# EAGLE schematic CharacterRom (EAGLE 7.3.0)

## Sheet 1 of 2
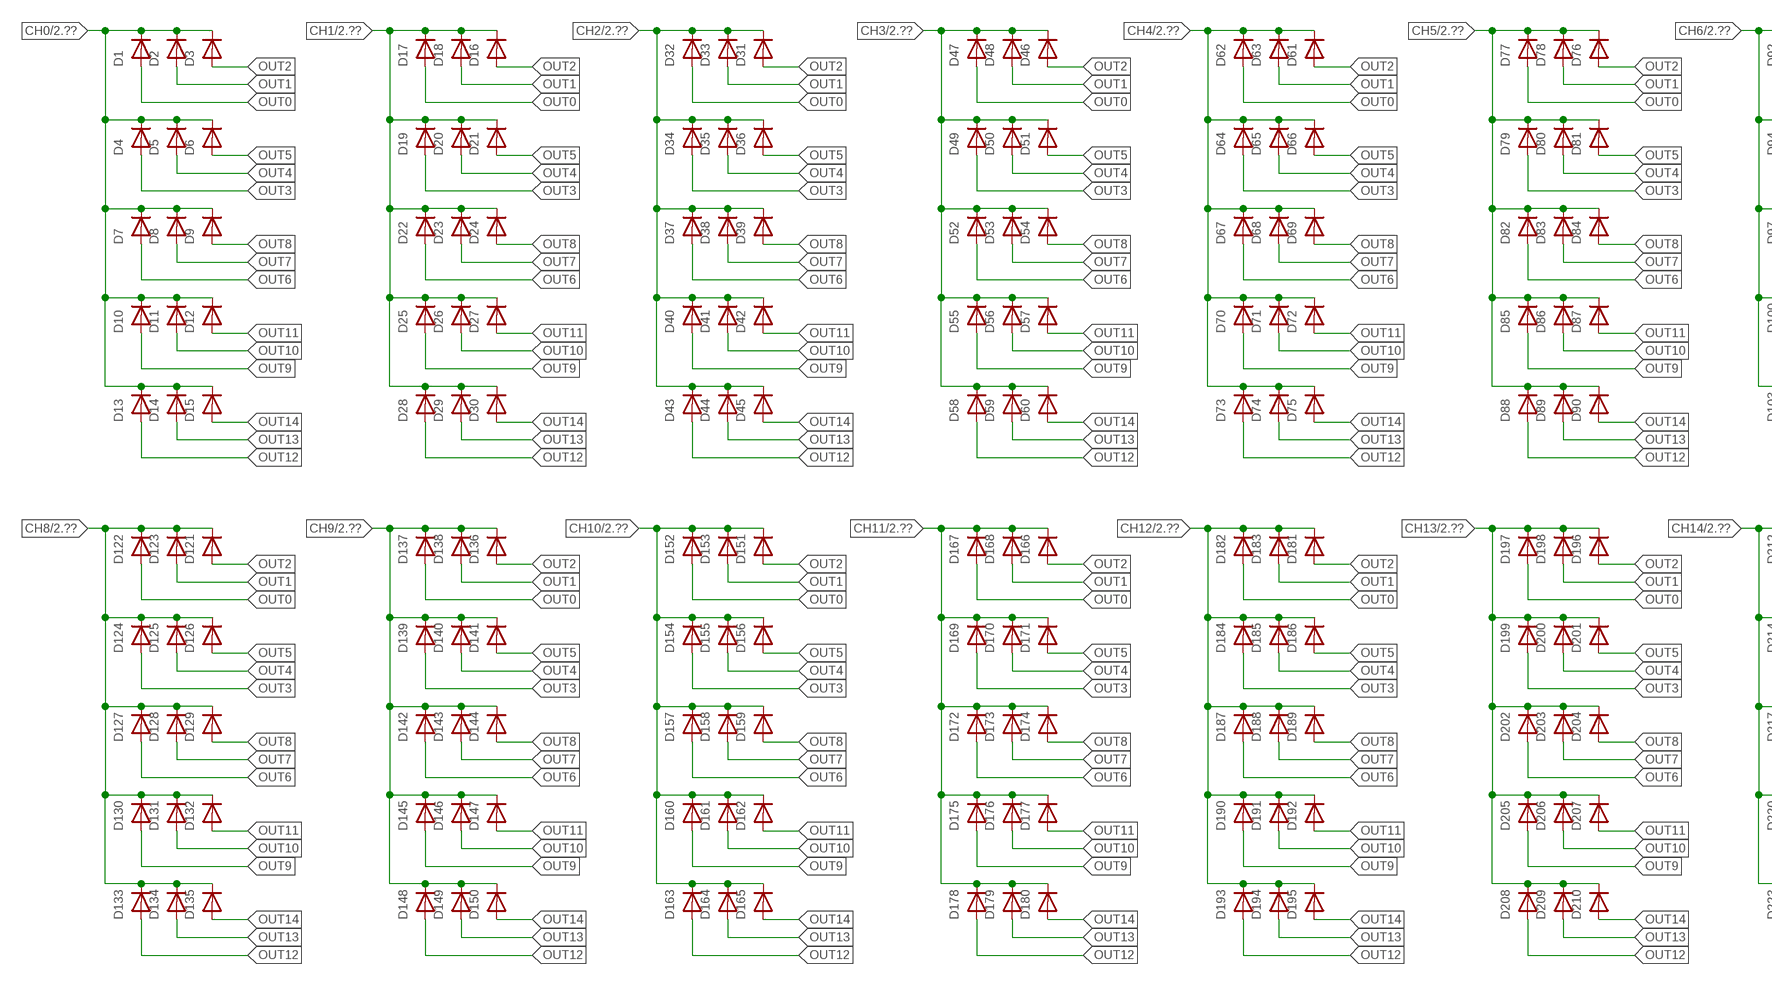
[diagram p0: schematic, sheet 1, part 1 of 2]
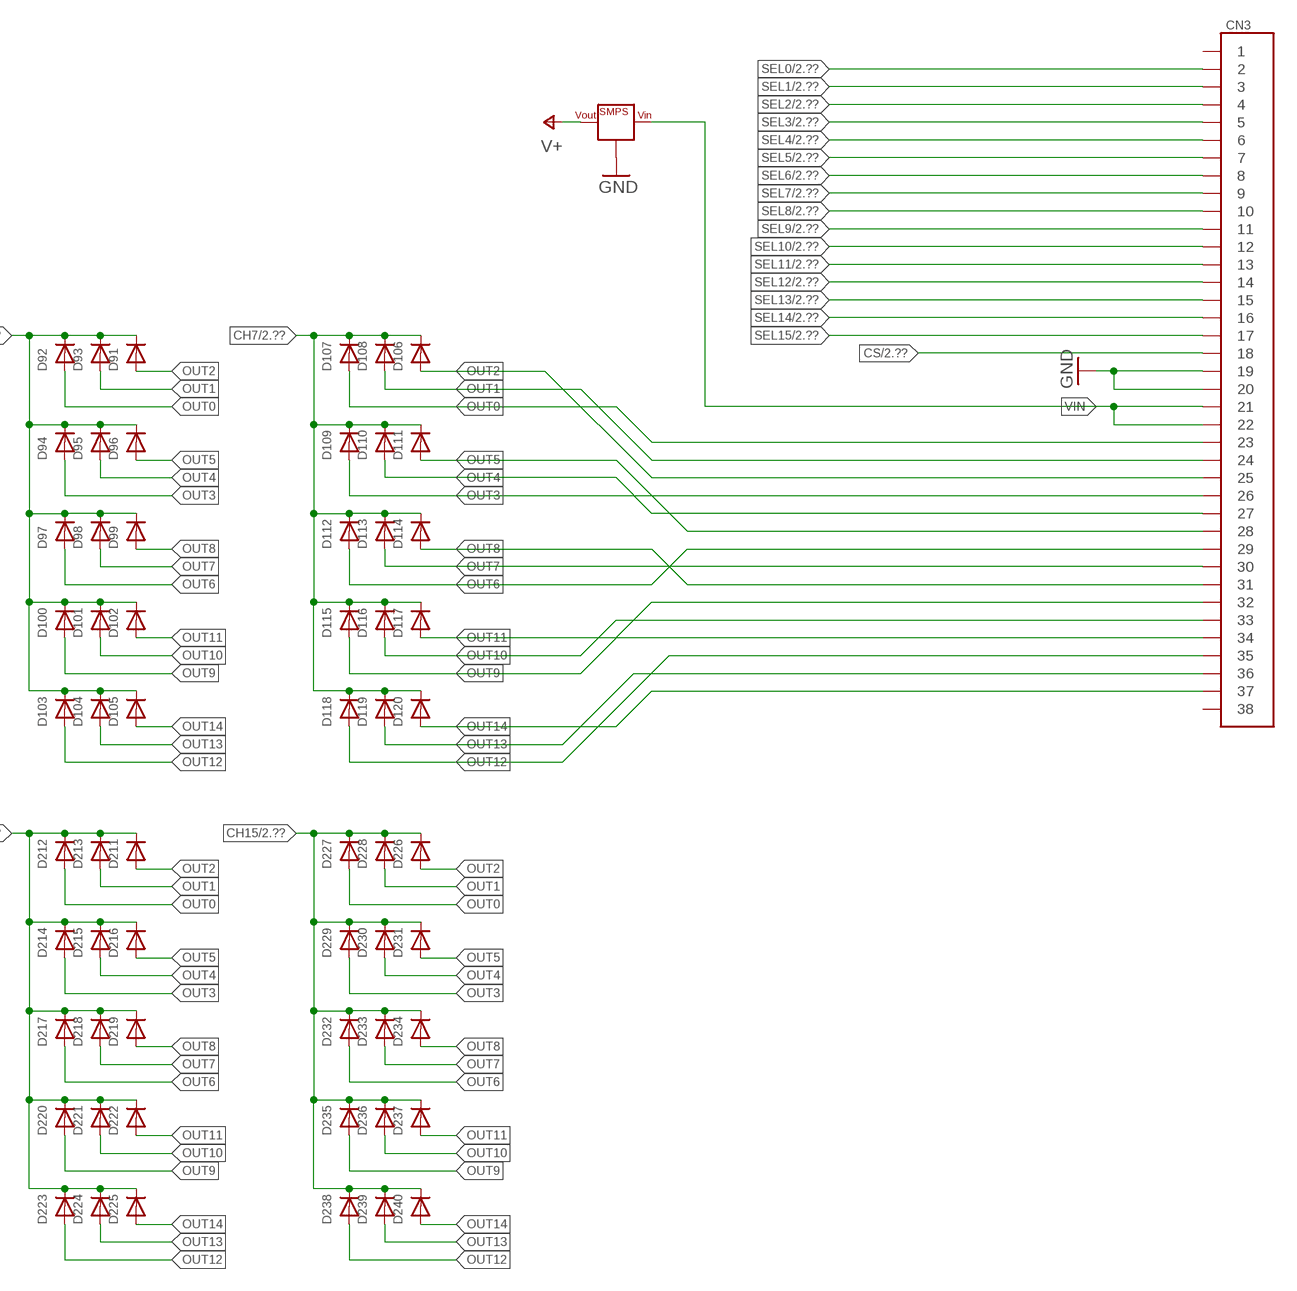
[diagram p1: schematic, sheet 1, part 2 of 2]

### Parts
CN3  HD38-HP  [HD38-HOLEPAD]
D1  DIODESOD-323F  [SOD-323F]
D2  DIODESOD-323F  [SOD-323F]
D3  DIODESOD-323F  [SOD-323F]
D4  DIODESOD-323F  [SOD-323F]
D5  DIODESOD-323F  [SOD-323F]
D6  DIODESOD-323F  [SOD-323F]
D7  DIODESOD-323F  [SOD-323F]
D8  DIODESOD-323F  [SOD-323F]
D9  DIODESOD-323F  [SOD-323F]
D10  DIODESOD-323F  [SOD-323F]
D11  DIODESOD-323F  [SOD-323F]
D12  DIODESOD-323F  [SOD-323F]
D13  DIODESOD-323F  [SOD-323F]
D14  DIODESOD-323F  [SOD-323F]
D15  DIODESOD-323F  [SOD-323F]
D16  DIODESOD-323F  [SOD-323F]
D17  DIODESOD-323F  [SOD-323F]
D18  DIODESOD-323F  [SOD-323F]
D19  DIODESOD-323F  [SOD-323F]
D20  DIODESOD-323F  [SOD-323F]
D21  DIODESOD-323F  [SOD-323F]
D22  DIODESOD-323F  [SOD-323F]
D23  DIODESOD-323F  [SOD-323F]
D24  DIODESOD-323F  [SOD-323F]
D25  DIODESOD-323F  [SOD-323F]
D26  DIODESOD-323F  [SOD-323F]
D27  DIODESOD-323F  [SOD-323F]
D28  DIODESOD-323F  [SOD-323F]
D29  DIODESOD-323F  [SOD-323F]
D30  DIODESOD-323F  [SOD-323F]
D31  DIODESOD-323F  [SOD-323F]
D32  DIODESOD-323F  [SOD-323F]
D33  DIODESOD-323F  [SOD-323F]
D34  DIODESOD-323F  [SOD-323F]
D35  DIODESOD-323F  [SOD-323F]
D36  DIODESOD-323F  [SOD-323F]
D37  DIODESOD-323F  [SOD-323F]
D38  DIODESOD-323F  [SOD-323F]
D39  DIODESOD-323F  [SOD-323F]
D40  DIODESOD-323F  [SOD-323F]
D41  DIODESOD-323F  [SOD-323F]
D42  DIODESOD-323F  [SOD-323F]
D43  DIODESOD-323F  [SOD-323F]
D44  DIODESOD-323F  [SOD-323F]
D45  DIODESOD-323F  [SOD-323F]
D46  DIODESOD-323F  [SOD-323F]
D47  DIODESOD-323F  [SOD-323F]
D48  DIODESOD-323F  [SOD-323F]
D49  DIODESOD-323F  [SOD-323F]
D50  DIODESOD-323F  [SOD-323F]
D51  DIODESOD-323F  [SOD-323F]
D52  DIODESOD-323F  [SOD-323F]
D53  DIODESOD-323F  [SOD-323F]
D54  DIODESOD-323F  [SOD-323F]
D55  DIODESOD-323F  [SOD-323F]
D56  DIODESOD-323F  [SOD-323F]
D57  DIODESOD-323F  [SOD-323F]
D58  DIODESOD-323F  [SOD-323F]
D59  DIODESOD-323F  [SOD-323F]
D60  DIODESOD-323F  [SOD-323F]
D61  DIODESOD-323F  [SOD-323F]
D62  DIODESOD-323F  [SOD-323F]
D63  DIODESOD-323F  [SOD-323F]
D64  DIODESOD-323F  [SOD-323F]
D65  DIODESOD-323F  [SOD-323F]
D66  DIODESOD-323F  [SOD-323F]
D67  DIODESOD-323F  [SOD-323F]
D68  DIODESOD-323F  [SOD-323F]
D69  DIODESOD-323F  [SOD-323F]
D70  DIODESOD-323F  [SOD-323F]
D71  DIODESOD-323F  [SOD-323F]
D72  DIODESOD-323F  [SOD-323F]
D73  DIODESOD-323F  [SOD-323F]
D74  DIODESOD-323F  [SOD-323F]
D75  DIODESOD-323F  [SOD-323F]
D76  DIODESOD-323F  [SOD-323F]
D77  DIODESOD-323F  [SOD-323F]
D78  DIODESOD-323F  [SOD-323F]
D79  DIODESOD-323F  [SOD-323F]
D80  DIODESOD-323F  [SOD-323F]
D81  DIODESOD-323F  [SOD-323F]
D82  DIODESOD-323F  [SOD-323F]
D83  DIODESOD-323F  [SOD-323F]
D84  DIODESOD-323F  [SOD-323F]
D85  DIODESOD-323F  [SOD-323F]
D86  DIODESOD-323F  [SOD-323F]
D87  DIODESOD-323F  [SOD-323F]
D88  DIODESOD-323F  [SOD-323F]
D89  DIODESOD-323F  [SOD-323F]
D90  DIODESOD-323F  [SOD-323F]
D91  DIODESOD-323F  [SOD-323F]
D92  DIODESOD-323F  [SOD-323F]
D93  DIODESOD-323F  [SOD-323F]
D94  DIODESOD-323F  [SOD-323F]
D95  DIODESOD-323F  [SOD-323F]
D96  DIODESOD-323F  [SOD-323F]
D97  DIODESOD-323F  [SOD-323F]
D98  DIODESOD-323F  [SOD-323F]
D99  DIODESOD-323F  [SOD-323F]
D100  DIODESOD-323F  [SOD-323F]
D101  DIODESOD-323F  [SOD-323F]
D102  DIODESOD-323F  [SOD-323F]
D103  DIODESOD-323F  [SOD-323F]
D104  DIODESOD-323F  [SOD-323F]
D105  DIODESOD-323F  [SOD-323F]
D106  DIODESOD-323F  [SOD-323F]
D107  DIODESOD-323F  [SOD-323F]
D108  DIODESOD-323F  [SOD-323F]
D109  DIODESOD-323F  [SOD-323F]
D110  DIODESOD-323F  [SOD-323F]
D111  DIODESOD-323F  [SOD-323F]
D112  DIODESOD-323F  [SOD-323F]
D113  DIODESOD-323F  [SOD-323F]
D114  DIODESOD-323F  [SOD-323F]
D115  DIODESOD-323F  [SOD-323F]
D116  DIODESOD-323F  [SOD-323F]
D117  DIODESOD-323F  [SOD-323F]
D118  DIODESOD-323F  [SOD-323F]
D119  DIODESOD-323F  [SOD-323F]
D120  DIODESOD-323F  [SOD-323F]
D121  DIODESOD-323F  [SOD-323F]
D122  DIODESOD-323F  [SOD-323F]
D123  DIODESOD-323F  [SOD-323F]
D124  DIODESOD-323F  [SOD-323F]
D125  DIODESOD-323F  [SOD-323F]
D126  DIODESOD-323F  [SOD-323F]
D127  DIODESOD-323F  [SOD-323F]
D128  DIODESOD-323F  [SOD-323F]
D129  DIODESOD-323F  [SOD-323F]
D130  DIODESOD-323F  [SOD-323F]
D131  DIODESOD-323F  [SOD-323F]
D132  DIODESOD-323F  [SOD-323F]
D133  DIODESOD-323F  [SOD-323F]
D134  DIODESOD-323F  [SOD-323F]
D135  DIODESOD-323F  [SOD-323F]
D136  DIODESOD-323F  [SOD-323F]
D137  DIODESOD-323F  [SOD-323F]
D138  DIODESOD-323F  [SOD-323F]
D139  DIODESOD-323F  [SOD-323F]
D140  DIODESOD-323F  [SOD-323F]
D141  DIODESOD-323F  [SOD-323F]
D142  DIODESOD-323F  [SOD-323F]
D143  DIODESOD-323F  [SOD-323F]
D144  DIODESOD-323F  [SOD-323F]
D145  DIODESOD-323F  [SOD-323F]
D146  DIODESOD-323F  [SOD-323F]
D147  DIODESOD-323F  [SOD-323F]
D148  DIODESOD-323F  [SOD-323F]
D149  DIODESOD-323F  [SOD-323F]
D150  DIODESOD-323F  [SOD-323F]
D151  DIODESOD-323F  [SOD-323F]
D152  DIODESOD-323F  [SOD-323F]
D153  DIODESOD-323F  [SOD-323F]
D154  DIODESOD-323F  [SOD-323F]
D155  DIODESOD-323F  [SOD-323F]
D156  DIODESOD-323F  [SOD-323F]
D157  DIODESOD-323F  [SOD-323F]
D158  DIODESOD-323F  [SOD-323F]
D159  DIODESOD-323F  [SOD-323F]
D160  DIODESOD-323F  [SOD-323F]
D161  DIODESOD-323F  [SOD-323F]
D162  DIODESOD-323F  [SOD-323F]
D163  DIODESOD-323F  [SOD-323F]
D164  DIODESOD-323F  [SOD-323F]
D165  DIODESOD-323F  [SOD-323F]
D166  DIODESOD-323F  [SOD-323F]
D167  DIODESOD-323F  [SOD-323F]
D168  DIODESOD-323F  [SOD-323F]
D169  DIODESOD-323F  [SOD-323F]
D170  DIODESOD-323F  [SOD-323F]
D171  DIODESOD-323F  [SOD-323F]
D172  DIODESOD-323F  [SOD-323F]
D173  DIODESOD-323F  [SOD-323F]
D174  DIODESOD-323F  [SOD-323F]
D175  DIODESOD-323F  [SOD-323F]
D176  DIODESOD-323F  [SOD-323F]
D177  DIODESOD-323F  [SOD-323F]
D178  DIODESOD-323F  [SOD-323F]
D179  DIODESOD-323F  [SOD-323F]
D180  DIODESOD-323F  [SOD-323F]
D181  DIODESOD-323F  [SOD-323F]
D182  DIODESOD-323F  [SOD-323F]
D183  DIODESOD-323F  [SOD-323F]
D184  DIODESOD-323F  [SOD-323F]
D185  DIODESOD-323F  [SOD-323F]
D186  DIODESOD-323F  [SOD-323F]
D187  DIODESOD-323F  [SOD-323F]
D188  DIODESOD-323F  [SOD-323F]
D189  DIODESOD-323F  [SOD-323F]
D190  DIODESOD-323F  [SOD-323F]
D191  DIODESOD-323F  [SOD-323F]
D192  DIODESOD-323F  [SOD-323F]
D193  DIODESOD-323F  [SOD-323F]
D194  DIODESOD-323F  [SOD-323F]
D195  DIODESOD-323F  [SOD-323F]
D196  DIODESOD-323F  [SOD-323F]
D197  DIODESOD-323F  [SOD-323F]
D198  DIODESOD-323F  [SOD-323F]
D199  DIODESOD-323F  [SOD-323F]
D200  DIODESOD-323F  [SOD-323F]
D201  DIODESOD-323F  [SOD-323F]
D202  DIODESOD-323F  [SOD-323F]
D203  DIODESOD-323F  [SOD-323F]
D204  DIODESOD-323F  [SOD-323F]
D205  DIODESOD-323F  [SOD-323F]
D206  DIODESOD-323F  [SOD-323F]
D207  DIODESOD-323F  [SOD-323F]
D208  DIODESOD-323F  [SOD-323F]
D209  DIODESOD-323F  [SOD-323F]
D210  DIODESOD-323F  [SOD-323F]
D211  DIODESOD-323F  [SOD-323F]
D212  DIODESOD-323F  [SOD-323F]
D213  DIODESOD-323F  [SOD-323F]
D214  DIODESOD-323F  [SOD-323F]
D215  DIODESOD-323F  [SOD-323F]
D216  DIODESOD-323F  [SOD-323F]
D217  DIODESOD-323F  [SOD-323F]
D218  DIODESOD-323F  [SOD-323F]
D219  DIODESOD-323F  [SOD-323F]
D220  DIODESOD-323F  [SOD-323F]
D221  DIODESOD-323F  [SOD-323F]
D222  DIODESOD-323F  [SOD-323F]
D223  DIODESOD-323F  [SOD-323F]
D224  DIODESOD-323F  [SOD-323F]
D225  DIODESOD-323F  [SOD-323F]
D226  DIODESOD-323F  [SOD-323F]
D227  DIODESOD-323F  [SOD-323F]
D228  DIODESOD-323F  [SOD-323F]
D229  DIODESOD-323F  [SOD-323F]
D230  DIODESOD-323F  [SOD-323F]
D231  DIODESOD-323F  [SOD-323F]
D232  DIODESOD-323F  [SOD-323F]
D233  DIODESOD-323F  [SOD-323F]
D234  DIODESOD-323F  [SOD-323F]
D235  DIODESOD-323F  [SOD-323F]
D236  DIODESOD-323F  [SOD-323F]
D237  DIODESOD-323F  [SOD-323F]
D238  DIODESOD-323F  [SOD-323F]
D239  DIODESOD-323F  [SOD-323F]
D240  DIODESOD-323F  [SOD-323F]
VR1  SMPS  [BUCK1722]

### Nets
CH0: D1.C D2.C D3.C D4.C D5.C D6.C D7.C D8.C D9.C D10.C D11.C D12.C D13.C D14.C D15.C ; also sheet 2
CH1: D16.C D17.C D18.C D19.C D20.C D21.C D22.C D23.C D24.C D25.C D26.C D27.C D28.C D29.C D30.C ; also sheet 2
CH2: D31.C D32.C D33.C D34.C D35.C D36.C D37.C D38.C D39.C D40.C D41.C D42.C D43.C D44.C D45.C ; also sheet 2
CH3: D46.C D47.C D48.C D49.C D50.C D51.C D52.C D53.C D54.C D55.C D56.C D57.C D58.C D59.C D60.C ; also sheet 2
CH4: D61.C D62.C D63.C D64.C D65.C D66.C D67.C D68.C D69.C D70.C D71.C D72.C D73.C D74.C D75.C ; also sheet 2
CH5: D76.C D77.C D78.C D79.C D80.C D81.C D82.C D83.C D84.C D85.C D86.C D87.C D88.C D89.C D90.C ; also sheet 2
CH6: D91.C D92.C D93.C D94.C D95.C D96.C D97.C D98.C D99.C D100.C D101.C D102.C D103.C D104.C D105.C ; also sheet 2
CH7: D106.C D107.C D108.C D109.C D110.C D111.C D112.C D113.C D114.C D115.C D116.C D117.C D118.C D119.C D120.C ; also sheet 2
CH8: D121.C D122.C D123.C D124.C D125.C D126.C D127.C D128.C D129.C D130.C D131.C D132.C D133.C D134.C D135.C ; also sheet 2
CH9: D136.C D137.C D138.C D139.C D140.C D141.C D142.C D143.C D144.C D145.C D146.C D147.C D148.C D149.C D150.C ; also sheet 2
CH10: D151.C D152.C D153.C D154.C D155.C D156.C D157.C D158.C D159.C D160.C D161.C D162.C D163.C D164.C D165.C ; also sheet 2
CH11: D166.C D167.C D168.C D169.C D170.C D171.C D172.C D173.C D174.C D175.C D176.C D177.C D178.C D179.C D180.C ; also sheet 2
CH12: D181.C D182.C D183.C D184.C D185.C D186.C D187.C D188.C D189.C D190.C D191.C D192.C D193.C D194.C D195.C ; also sheet 2
CH13: D196.C D197.C D198.C D199.C D200.C D201.C D202.C D203.C D204.C D205.C D206.C D207.C D208.C D209.C D210.C ; also sheet 2
CH14: D211.C D212.C D213.C D214.C D215.C D216.C D217.C D218.C D219.C D220.C D221.C D222.C D223.C D224.C D225.C ; also sheet 2
CH15: D226.C D227.C D228.C D229.C D230.C D231.C D232.C D233.C D234.C D235.C D236.C D237.C D238.C D239.C D240.C ; also sheet 2
CS: CN3.P18@1 CN3.P18@2 ; also sheet 2
GND: CN3.P19@1 CN3.P19@2 CN3.P20@1 CN3.P20@2 VR1.GND@1(GND) VR1.GND@2(GND) VR1.GND@3(GND) VR1.GND@4(GND) ; also sheet 2
OUT0: CN3.P23@1 CN3.P23@2 D1.A D17.A D32.A D47.A D62.A D77.A D92.A D107.A D122.A D137.A D152.A D167.A D182.A D197.A D212.A D227.A
OUT1: CN3.P24@1 CN3.P24@2 D2.A D18.A D33.A D48.A D63.A D78.A D93.A D108.A D123.A D138.A D153.A D168.A D183.A D198.A D213.A D228.A
OUT2: CN3.P25@1 CN3.P25@2 D3.A D16.A D31.A D46.A D61.A D76.A D91.A D106.A D121.A D136.A D151.A D166.A D181.A D196.A D211.A D226.A
OUT3: CN3.P26@1 CN3.P26@2 D4.A D19.A D34.A D49.A D64.A D79.A D94.A D109.A D124.A D139.A D154.A D169.A D184.A D199.A D214.A D229.A
OUT4: CN3.P27@1 CN3.P27@2 D5.A D20.A D35.A D50.A D65.A D80.A D95.A D110.A D125.A D140.A D155.A D170.A D185.A D200.A D215.A D230.A
OUT5: CN3.P28@1 CN3.P28@2 D6.A D21.A D36.A D51.A D66.A D81.A D96.A D111.A D126.A D141.A D156.A D171.A D186.A D201.A D216.A D231.A
OUT6: CN3.P29@1 CN3.P29@2 D7.A D22.A D37.A D52.A D67.A D82.A D97.A D112.A D127.A D142.A D157.A D172.A D187.A D202.A D217.A D232.A
OUT7: CN3.P30@1 CN3.P30@2 D8.A D23.A D38.A D53.A D68.A D83.A D98.A D113.A D128.A D143.A D158.A D173.A D188.A D203.A D218.A D233.A
OUT8: CN3.P31@1 CN3.P31@2 D9.A D24.A D39.A D54.A D69.A D84.A D99.A D114.A D129.A D144.A D159.A D174.A D189.A D204.A D219.A D234.A
OUT9: CN3.P32@1 CN3.P32@2 D10.A D25.A D40.A D55.A D70.A D85.A D100.A D115.A D130.A D145.A D160.A D175.A D190.A D205.A D220.A D235.A
OUT10: CN3.P33@1 CN3.P33@2 D11.A D26.A D41.A D56.A D71.A D86.A D101.A D116.A D131.A D146.A D161.A D176.A D191.A D206.A D221.A D236.A
OUT11: CN3.P34@1 CN3.P34@2 D12.A D27.A D42.A D57.A D72.A D87.A D102.A D117.A D132.A D147.A D162.A D177.A D192.A D207.A D222.A D237.A
OUT12: CN3.P35@1 CN3.P35@2 D13.A D28.A D43.A D58.A D73.A D88.A D103.A D118.A D133.A D148.A D163.A D178.A D193.A D208.A D223.A D238.A
OUT13: CN3.P36@1 CN3.P36@2 D14.A D29.A D44.A D59.A D74.A D89.A D104.A D119.A D134.A D149.A D164.A D179.A D194.A D209.A D224.A D239.A
OUT14: CN3.P37@1 CN3.P37@2 D15.A D30.A D45.A D60.A D75.A D90.A D105.A D120.A D135.A D150.A D165.A D180.A D195.A D210.A D225.A D240.A
SEL0: CN3.P2@1 CN3.P2@2 ; also sheet 2
SEL1: CN3.P3@1 CN3.P3@2 ; also sheet 2
SEL2: CN3.P4@1 CN3.P4@2 ; also sheet 2
SEL3: CN3.P5@1 CN3.P5@2 ; also sheet 2
SEL4: CN3.P6@1 CN3.P6@2 ; also sheet 2
SEL5: CN3.P7@1 CN3.P7@2 ; also sheet 2
SEL6: CN3.P8@1 CN3.P8@2 ; also sheet 2
SEL7: CN3.P9@1 CN3.P9@2 ; also sheet 2
SEL8: CN3.P10@1 CN3.P10@2 ; also sheet 2
SEL9: CN3.P11@1 CN3.P11@2 ; also sheet 2
SEL10: CN3.P12@1 CN3.P12@2 ; also sheet 2
SEL11: CN3.P13@1 CN3.P13@2 ; also sheet 2
SEL12: CN3.P14@1 CN3.P14@2 ; also sheet 2
SEL13: CN3.P15@1 CN3.P15@2 ; also sheet 2
SEL14: CN3.P16@1 CN3.P16@2 ; also sheet 2
SEL15: CN3.P17@1 CN3.P17@2 ; also sheet 2
V+: VR1.OUT@1(VOUT) VR1.OUT@2(VOUT) ; also sheet 2
VIN: CN3.P21@1 CN3.P21@2 CN3.P22@1 CN3.P22@2 VR1.IN@1(VIN) VR1.IN@2(VIN)
Unconnected: CN3.P1@1 CN3.P1@2 CN3.P38@1 CN3.P38@2

## Sheet 2 of 2
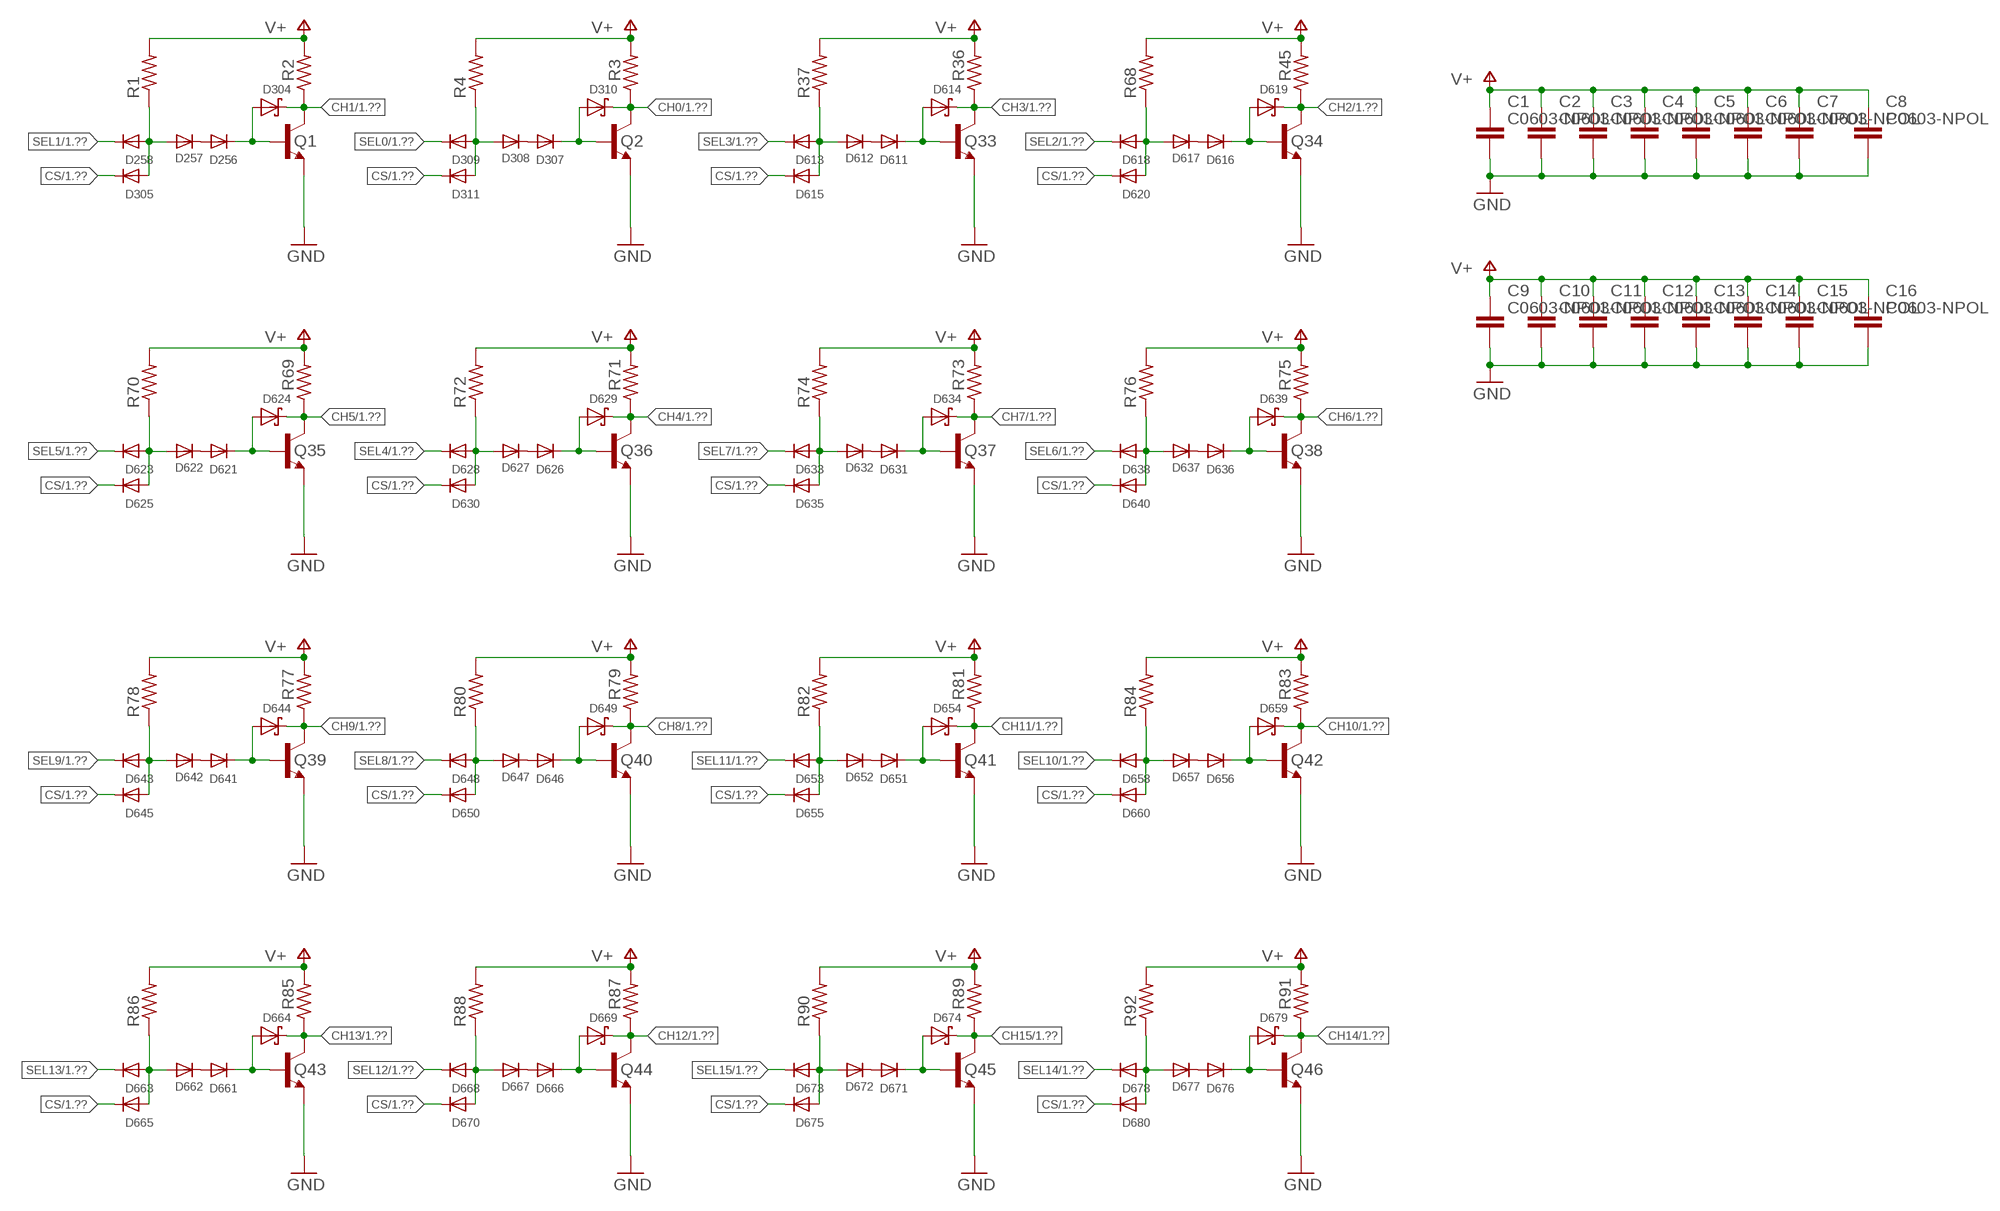
[diagram p2: schematic, sheet 2]

### Parts
C1  C0603-NPOL  [C0603]
C2  C0603-NPOL  [C0603]
C3  C0603-NPOL  [C0603]
C4  C0603-NPOL  [C0603]
C5  C0603-NPOL  [C0603]
C6  C0603-NPOL  [C0603]
C7  C0603-NPOL  [C0603]
C8  C0603-NPOL  [C0603]
C9  C0603-NPOL  [C0603]
C10  C0603-NPOL  [C0603]
C11  C0603-NPOL  [C0603]
C12  C0603-NPOL  [C0603]
C13  C0603-NPOL  [C0603]
C14  C0603-NPOL  [C0603]
C15  C0603-NPOL  [C0603]
C16  C0603-NPOL  [C0603]
D256  DIODE-SOD323  [SOD323F]
D257  DIODE-SOD323  [SOD323F]
D258  DIODE-SOD323  [SOD323F]
D304  SCHOTTKYSOT323  [SOT23]
D305  DIODE-SOD323  [SOD323F]
D307  DIODE-SOD323  [SOD323F]
D308  DIODE-SOD323  [SOD323F]
D309  DIODE-SOD323  [SOD323F]
D310  SCHOTTKYSOT323  [SOT23]
D311  DIODE-SOD323  [SOD323F]
D611  DIODE-SOD323  [SOD323F]
D612  DIODE-SOD323  [SOD323F]
D613  DIODE-SOD323  [SOD323F]
D614  SCHOTTKYSOT323  [SOT23]
D615  DIODE-SOD323  [SOD323F]
D616  DIODE-SOD323  [SOD323F]
D617  DIODE-SOD323  [SOD323F]
D618  DIODE-SOD323  [SOD323F]
D619  SCHOTTKYSOT323  [SOT23]
D620  DIODE-SOD323  [SOD323F]
D621  DIODE-SOD323  [SOD323F]
D622  DIODE-SOD323  [SOD323F]
D623  DIODE-SOD323  [SOD323F]
D624  SCHOTTKYSOT323  [SOT23]
D625  DIODE-SOD323  [SOD323F]
D626  DIODE-SOD323  [SOD323F]
D627  DIODE-SOD323  [SOD323F]
D628  DIODE-SOD323  [SOD323F]
D629  SCHOTTKYSOT323  [SOT23]
D630  DIODE-SOD323  [SOD323F]
D631  DIODE-SOD323  [SOD323F]
D632  DIODE-SOD323  [SOD323F]
D633  DIODE-SOD323  [SOD323F]
D634  SCHOTTKYSOT323  [SOT23]
D635  DIODE-SOD323  [SOD323F]
D636  DIODE-SOD323  [SOD323F]
D637  DIODE-SOD323  [SOD323F]
D638  DIODE-SOD323  [SOD323F]
D639  SCHOTTKYSOT323  [SOT23]
D640  DIODE-SOD323  [SOD323F]
D641  DIODE-SOD323  [SOD323F]
D642  DIODE-SOD323  [SOD323F]
D643  DIODE-SOD323  [SOD323F]
D644  SCHOTTKYSOT323  [SOT23]
D645  DIODE-SOD323  [SOD323F]
D646  DIODE-SOD323  [SOD323F]
D647  DIODE-SOD323  [SOD323F]
D648  DIODE-SOD323  [SOD323F]
D649  SCHOTTKYSOT323  [SOT23]
D650  DIODE-SOD323  [SOD323F]
D651  DIODE-SOD323  [SOD323F]
D652  DIODE-SOD323  [SOD323F]
D653  DIODE-SOD323  [SOD323F]
D654  SCHOTTKYSOT323  [SOT23]
D655  DIODE-SOD323  [SOD323F]
D656  DIODE-SOD323  [SOD323F]
D657  DIODE-SOD323  [SOD323F]
D658  DIODE-SOD323  [SOD323F]
D659  SCHOTTKYSOT323  [SOT23]
D660  DIODE-SOD323  [SOD323F]
D661  DIODE-SOD323  [SOD323F]
D662  DIODE-SOD323  [SOD323F]
D663  DIODE-SOD323  [SOD323F]
D664  SCHOTTKYSOT323  [SOT23]
D665  DIODE-SOD323  [SOD323F]
D666  DIODE-SOD323  [SOD323F]
D667  DIODE-SOD323  [SOD323F]
D668  DIODE-SOD323  [SOD323F]
D669  SCHOTTKYSOT323  [SOT23]
D670  DIODE-SOD323  [SOD323F]
D671  DIODE-SOD323  [SOD323F]
D672  DIODE-SOD323  [SOD323F]
D673  DIODE-SOD323  [SOD323F]
D674  SCHOTTKYSOT323  [SOT23]
D675  DIODE-SOD323  [SOD323F]
D676  DIODE-SOD323  [SOD323F]
D677  DIODE-SOD323  [SOD323F]
D678  DIODE-SOD323  [SOD323F]
D679  SCHOTTKYSOT323  [SOT23]
D680  DIODE-SOD323  [SOD323F]
Q1  BC547-SOT23  [SOT23]
Q2  BC547-SOT23  [SOT23]
Q33  BC547-SOT23  [SOT23]
Q34  BC547-SOT23  [SOT23]
Q35  BC547-SOT23  [SOT23]
Q36  BC547-SOT23  [SOT23]
Q37  BC547-SOT23  [SOT23]
Q38  BC547-SOT23  [SOT23]
Q39  BC547-SOT23  [SOT23]
Q40  BC547-SOT23  [SOT23]
Q41  BC547-SOT23  [SOT23]
Q42  BC547-SOT23  [SOT23]
Q43  BC547-SOT23  [SOT23]
Q44  BC547-SOT23  [SOT23]
Q45  BC547-SOT23  [SOT23]
Q46  BC547-SOT23  [SOT23]
R1  470  R-0805  [R0805]
R2  150  R-0805  [R0805]
R3  150  R-0805  [R0805]
R4  470  R-0805  [R0805]
R36  150  R-0805  [R0805]
R37  470  R-0805  [R0805]
R45  150  R-0805  [R0805]
R68  470  R-0805  [R0805]
R69  150  R-0805  [R0805]
R70  470  R-0805  [R0805]
R71  150  R-0805  [R0805]
R72  470  R-0805  [R0805]
R73  150  R-0805  [R0805]
R74  470  R-0805  [R0805]
R75  150  R-0805  [R0805]
R76  470  R-0805  [R0805]
R77  150  R-0805  [R0805]
R78  470  R-0805  [R0805]
R79  150  R-0805  [R0805]
R80  470  R-0805  [R0805]
R81  150  R-0805  [R0805]
R82  470  R-0805  [R0805]
R83  150  R-0805  [R0805]
R84  470  R-0805  [R0805]
R85  150  R-0805  [R0805]
R86  470  R-0805  [R0805]
R87  150  R-0805  [R0805]
R88  470  R-0805  [R0805]
R89  150  R-0805  [R0805]
R90  470  R-0805  [R0805]
R91  150  R-0805  [R0805]
R92  470  R-0805  [R0805]

### Nets
CH0: D310.3(C) Q2.3(C) R3.1 ; also sheet 1
CH1: D304.3(C) Q1.3(C) R2.1 ; also sheet 1
CH2: D619.3(C) Q34.3(C) R45.1 ; also sheet 1
CH3: D614.3(C) Q33.3(C) R36.1 ; also sheet 1
CH4: D629.3(C) Q36.3(C) R71.1 ; also sheet 1
CH5: D624.3(C) Q35.3(C) R69.1 ; also sheet 1
CH6: D639.3(C) Q38.3(C) R75.1 ; also sheet 1
CH7: D634.3(C) Q37.3(C) R73.1 ; also sheet 1
CH8: D649.3(C) Q40.3(C) R79.1 ; also sheet 1
CH9: D644.3(C) Q39.3(C) R77.1 ; also sheet 1
CH10: D659.3(C) Q42.3(C) R83.1 ; also sheet 1
CH11: D654.3(C) Q41.3(C) R81.1 ; also sheet 1
CH12: D669.3(C) Q44.3(C) R87.1 ; also sheet 1
CH13: D664.3(C) Q43.3(C) R85.1 ; also sheet 1
CH14: D679.3(C) Q46.3(C) R91.1 ; also sheet 1
CH15: D674.3(C) Q45.3(C) R89.1 ; also sheet 1
CS: D305.C D311.C D615.C D620.C D625.C D630.C D635.C D640.C D645.C D650.C D655.C D660.C D665.C D670.C D675.C D680.C ; also sheet 1
GND: C1.2 C2.2 C3.2 C4.2 C5.2 C6.2 C7.2 C8.2 C9.2 C10.2 C11.2 C12.2 C13.2 C14.2 C15.2 C16.2 Q1.2(E) Q2.2(E) Q33.2(E) Q34.2(E) Q35.2(E) Q36.2(E) Q37.2(E) Q38.2(E) Q39.2(E) Q40.2(E) Q41.2(E) Q42.2(E) Q43.2(E) Q44.2(E) Q45.2(E) Q46.2(E) ; also sheet 1
N$137: D256.C D304.1(A) Q1.1(B)
N$145: D256.A D257.C
N$176: D257.A D258.A D305.A R1.1
N$177: D307.C D310.1(A) Q2.1(B)
N$178: D307.A D308.C
N$179: D308.A D309.A D311.A R4.1
N$227: D611.C D614.1(A) Q33.1(B)
N$228: D611.A D612.C
N$229: D612.A D613.A D615.A R37.1
N$230: D616.C D619.1(A) Q34.1(B)
N$231: D616.A D617.C
N$232: D617.A D618.A D620.A R68.1
N$363: D621.C D624.1(A) Q35.1(B)
N$364: D621.A D622.C
N$365: D622.A D623.A D625.A R70.1
N$366: D626.C D629.1(A) Q36.1(B)
N$367: D626.A D627.C
N$368: D627.A D628.A D630.A R72.1
N$369: D631.C D634.1(A) Q37.1(B)
N$370: D631.A D632.C
N$371: D632.A D633.A D635.A R74.1
N$372: D636.C D639.1(A) Q38.1(B)
N$373: D636.A D637.C
N$374: D637.A D638.A D640.A R76.1
N$635: D641.C D644.1(A) Q39.1(B)
N$636: D641.A D642.C
N$637: D642.A D643.A D645.A R78.1
N$638: D646.C D649.1(A) Q40.1(B)
N$639: D646.A D647.C
N$640: D647.A D648.A D650.A R80.1
N$641: D651.C D654.1(A) Q41.1(B)
N$642: D651.A D652.C
N$643: D652.A D653.A D655.A R82.1
N$644: D656.C D659.1(A) Q42.1(B)
N$645: D656.A D657.C
N$646: D657.A D658.A D660.A R84.1
N$647: D661.C D664.1(A) Q43.1(B)
N$648: D661.A D662.C
N$649: D662.A D663.A D665.A R86.1
N$650: D666.C D669.1(A) Q44.1(B)
N$651: D666.A D667.C
N$652: D667.A D668.A D670.A R88.1
N$653: D671.C D674.1(A) Q45.1(B)
N$654: D671.A D672.C
N$655: D672.A D673.A D675.A R90.1
N$656: D676.C D679.1(A) Q46.1(B)
N$657: D676.A D677.C
N$658: D677.A D678.A D680.A R92.1
SEL0: D309.C ; also sheet 1
SEL1: D258.C ; also sheet 1
SEL2: D618.C ; also sheet 1
SEL3: D613.C ; also sheet 1
SEL4: D628.C ; also sheet 1
SEL5: D623.C ; also sheet 1
SEL6: D638.C ; also sheet 1
SEL7: D633.C ; also sheet 1
SEL8: D648.C ; also sheet 1
SEL9: D643.C ; also sheet 1
SEL10: D658.C ; also sheet 1
SEL11: D653.C ; also sheet 1
SEL12: D668.C ; also sheet 1
SEL13: D663.C ; also sheet 1
SEL14: D678.C ; also sheet 1
SEL15: D673.C ; also sheet 1
V+: C1.1 C2.1 C3.1 C4.1 C5.1 C6.1 C7.1 C8.1 C9.1 C10.1 C11.1 C12.1 C13.1 C14.1 C15.1 C16.1 R1.2 R2.2 R3.2 R4.2 R36.2 R37.2 R45.2 R68.2 R69.2 R70.2 R71.2 R72.2 R73.2 R74.2 R75.2 R76.2 R77.2 R78.2 R79.2 R80.2 R81.2 R82.2 R83.2 R84.2 R85.2 R86.2 R87.2 R88.2 R89.2 R90.2 R91.2 R92.2 ; also sheet 1

## Library data of the parts
C1-C16 = SmallRoomLabs_Discrete:C0603
CN3 = SmallRoomLabs_ConSwitch:HD38
D1-D240 = adafruit:DIODE: Diode SMADIODE - SMA Surface Mount Package 20V 1A Schottky Diode Digikey: 641-1014-6-ND DO-1N4148 - Through Hole Small Current Diode SOD-123 20V 1 A (.5mV Vf) Schottky Diode - Digikey: MBRX120TPMSCT-ND SOD-323 10V 570mA (.38mV Vf, 3ns) Schottky Diode - Digikey: ZLLS410CT-ND SOD-523 30V 30mA Schottky Diode (RB751S-40TE61) - Digikey: RB751S-40TE61CT-ND SOT23-R/W - SOT23 Package (R = Solder Paste/Reflow Ovens, W = Hand-Soldering) BAT54Film 40V 300mA - Digikey: 497-7162-1-ND
D256-D258 D305 D307-D309 D311 D611-D613 D615-D618 D620-D623 D625-D628 D630-D633 D635-D638 D640-D643 D645-D648 D650-D653 D655-D658 D660-D663 D665-D668 D670-D673 D675-D678 D680 = SmallRoomLabs_Semiconductor:DIODE
D304 D310 D614 D619 D624 D629 D634 D639 D644 D649 D654 D659 D664 D669 D674 D679 = SmallRoomLabs_Semiconductor:SCHOTTKY
Q1 Q2 Q33-Q46 = SmallRoomLabs_Semiconductor:BC547
R1-R4 R36 R37 R45 R68-R92 = SmallRoomLabs_Discrete:R
VR1 = SmallRoomLabs_Battery:SMPS